# EAGLE design Soil_Moisture_Sensor_Pro_Mini (EAGLE 7.4.0)
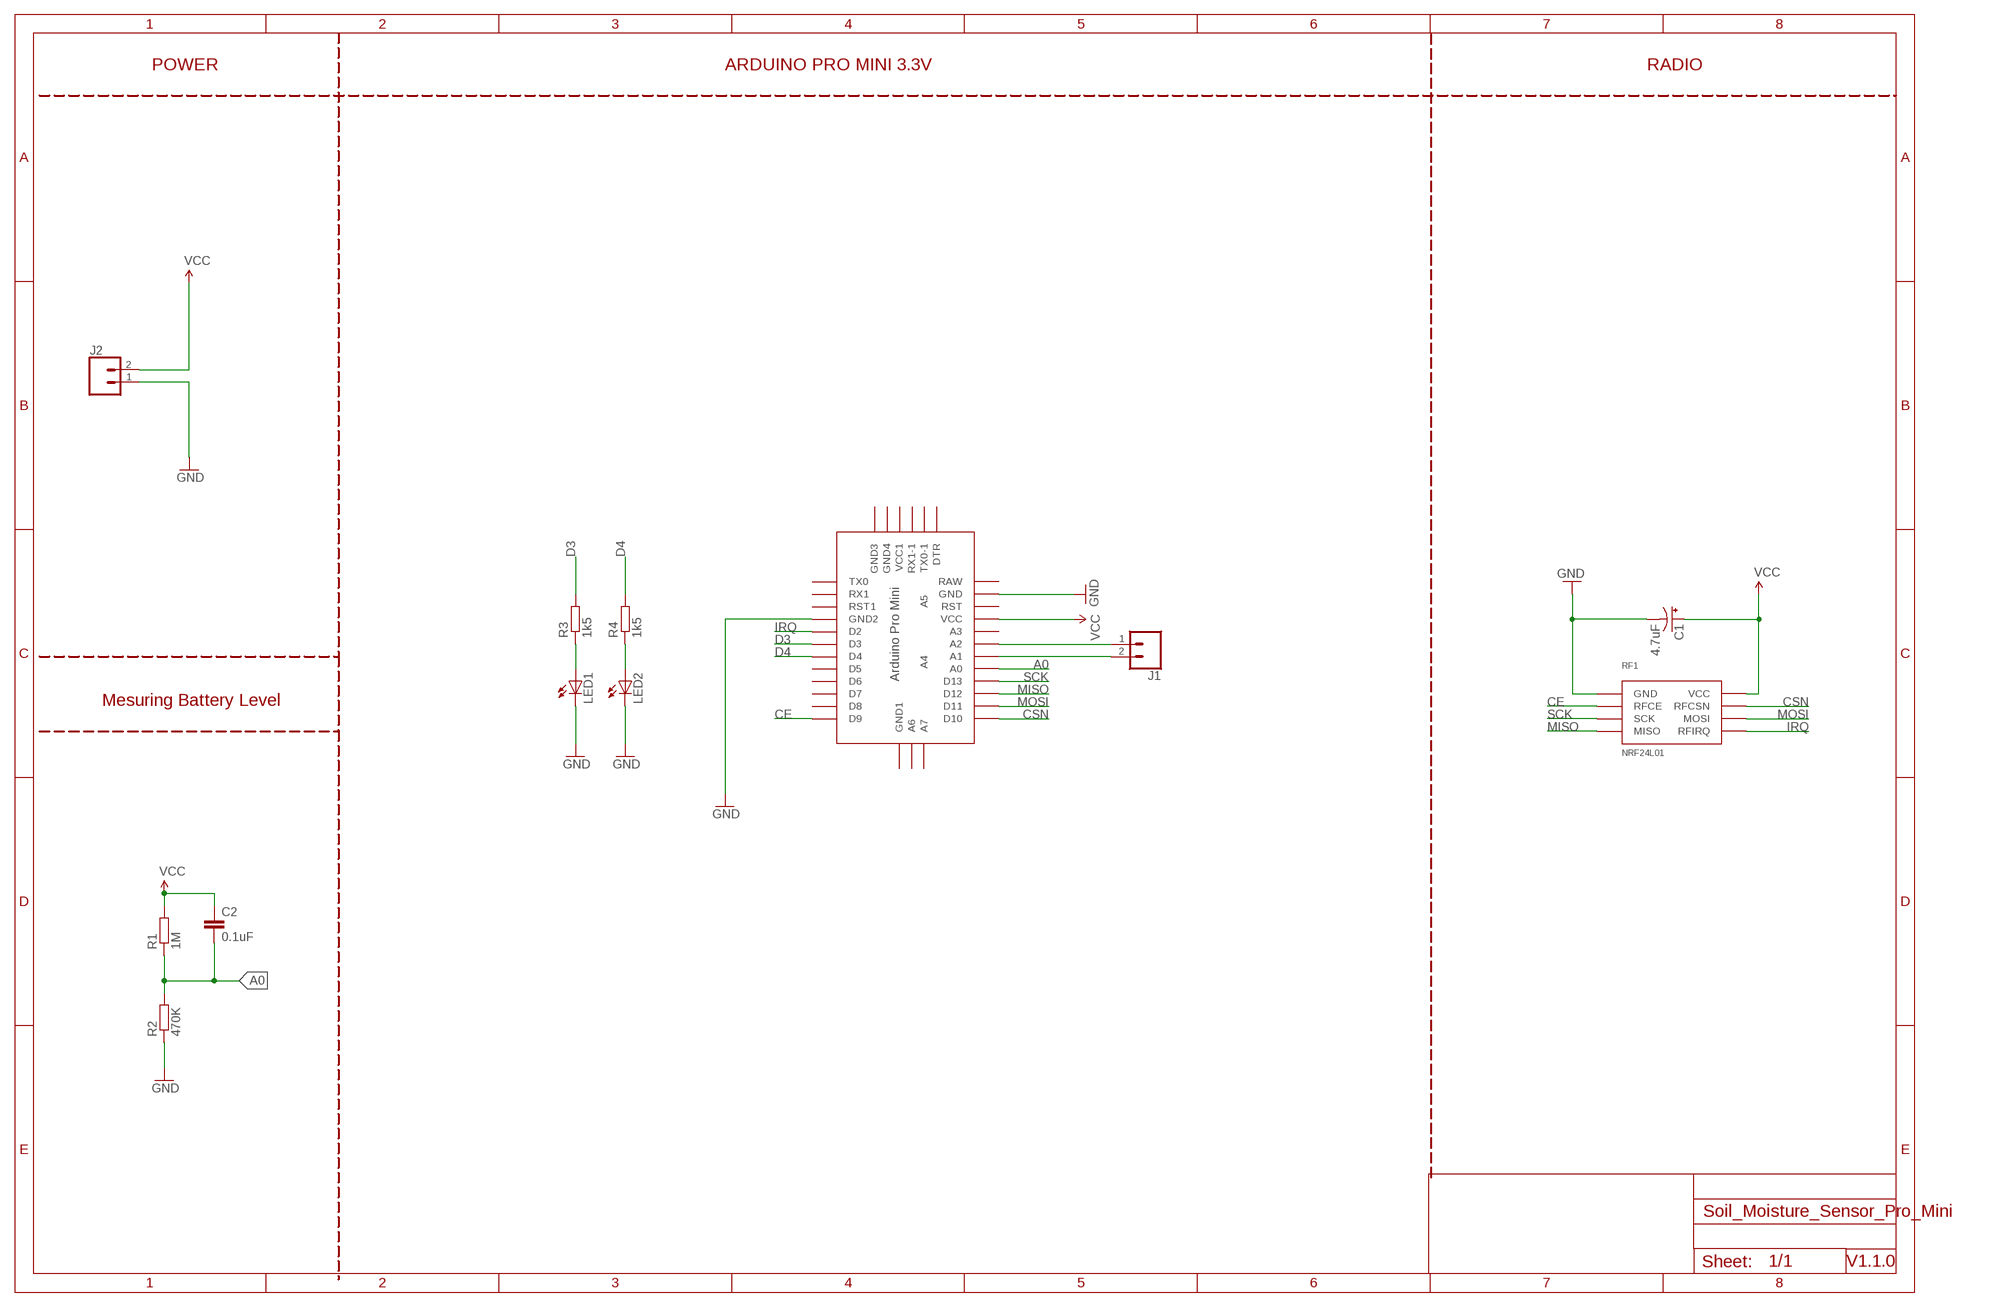
[diagram p0: schematic, sheet 1]

## Parts
C1  4.7uF  CPOL-USE2,5-6E  [E2,5-6E]
C2  0.1uF  C-EU025-025X050  [C025-025X050]
J1  CONN_02  [1X02]
J2  CONN_02  [1X02]
LED1  LED3MM  [LED3MM]
LED2  LED3MM  [LED3MM]
R1  1M  R-EU_0204/7  [0204/7]
R2  470K  R-EU_0204/7  [0204/7]
R3  1k5  R-EU_0204/7  [0204/7]
R4  1k5  R-EU_0204/7  [0204/7]
RF1  NRF24L01  [2X4-2.54MM]
U$1  ABK-PRO-MINI  [ABK-PRO-MINI]

## Nets
A0: C2.2 R1.1 R2.2 U$1.A0
CE: RF1.P$3(RFCE) U$1.D9
CSN: RF1.P$4(RFCSN) U$1.D10
D3: R3.2 U$1.D3
D4: R4.2 U$1.D4
GND [pwr]: C1.- J2.1 LED1.K(C) LED2.K(C) R2.1 RF1.P$1(GND) U$1.GND U$1.GND1(GND2)
IRQ: RF1.P$8(RFIRQ) U$1.D2
MISO: RF1.P$7(MISO) U$1.D12
MOSI: RF1.P$6(MOSI) U$1.D11
N$1: J1.1 U$1.A2
N$2: J1.2 U$1.A1
N$3: LED2.A R4.1
N$4: LED1.A R3.1
SCK: RF1.P$5(SCK) U$1.D13
VCC [pwr]: C1.+ C2.1 J2.2 R1.2 RF1.P$2(VCC) U$1.VCC
Unconnected: U$1.A3 U$1.A4 U$1.A5 U$1.A6 U$1.A7 U$1.D5 U$1.D6 U$1.D7 U$1.D8 U$1.DTR U$1.GND2(GND3) U$1.GND3(GND4) U$1.GND4(GND1) U$1.RAW U$1.RST U$1.RST1 U$1.RX1 U$1.RX1-1 U$1.TX0 U$1.TX0-1 U$1.VCC1

## Notes on the sheet
- POWER | ARDUINO PRO MINI 3.3V | RADIO
- Mesuring Battery Level
- V1.1.0

## Library data of the parts
C1 = adafruit:CPOL-US: POLARIZED CAPACITOR, American symbol
C2 = rcl:C-EU: CAPACITOR, European symbol
J1 J2 = SparkFun-Connectors:CONN_02: Multi connection point. Often used as Generic Header-pin footprint for 0.1 inch spaced/style header connections On any of the 0.1 inch spaced packages, you can populate with these: Break Away Headers - Straight <https://www.sparkfun.com/products/116> (PRT-00116) Break Away Male Headers - Right Angle <https://www.sparkfun.com/products/553> (PRT-00553) Female Headers <https://www.sparkfun.com/products/115> (PRT-00115) Break Away Headers - Machine Pin <https://www.sparkfun.com/products/117> (PRT-00117) Break Away Female Headers - Swiss Machine Pin <https://www.sparkfun.com/products/743> (PRT-00743) For SCREWTERMINALS and SPRING TERMINALS visit here: Screw Terimnals on SparkFun.com <https://www.sparkfun.com/search/results?term=Screw+Terminals> (5mm/3.5mm/2.54mm spacing) This device is also useful as a general connection point to wire up your design to another part of your project. Our various solder wires solder well into these plated through hole pads. Hook-Up Wire - Assortment (Stranded, 22 AWG) <https://www.sparkfun.com/products/11375> (PRT-11375) Hook-Up Wire - Assortment (Solid Core, 22 AWG) <https://www.sparkfun.com/products/11367> (PRT-11367) View the entire wire category on our website here <https://www.sparkfun.com/categories/141> Special notes: Molex polarized connector foot print use with: PRT-08233 with associated crimp pins and housings. 2.54_SCREWTERM for use with PRT-10571. 3.5mm Screw Terminal footprints for PRT-08084 5mm Screw Terminal footprints for use with PRT-08432
LED1 LED2 = led:LED: LED OSRAM: - CHIPLED LG R971, LG N971, LY N971, LG Q971, LY Q971, LO R971, LY R971 LH N974, LH R974 LS Q976, LO Q976, LY Q976 LO Q996 - Hyper CHIPLED LW Q18S LB Q993, LB Q99A, LB R99A - SideLED LS A670, LO A670, LY A670, LG A670, LP A670 LB A673, LV A673, LT A673, LW A673 LH A674 LY A675 LS A676, LA A676, LO A676, LY A676, LW A676 LS A679, LY A679, LG A679 - Hyper Micro SIDELED® LS Y876, LA Y876, LO Y876, LY Y876 LT Y87S - SmartLED LW L88C, LW L88S LB L89C, LB L89S, LG L890 LS L89K, LO L89K, LY L89K LS L896, LA L896, LO L896, LY L896 - TOPLED LS T670, LO T670, LY T670, LG T670, LP T670 LSG T670, LSP T670, LSY T670, LOP T670, LYG T670 LG T671, LOG T671, LSG T671 LB T673, LV T673, LT T673, LW T673 LH T674 LS T676, LA T676, LO T676, LY T676, LB T676, LH T676, LSB T676, LW T676 LB T67C, LV T67C, LT T67C, LS T67K, LO T67K, LY T67K, LW E67C LS E67B, LA E67B, LO E67B, LY E67B, LB E67C, LV E67C, LT E67C LW T67C LS T679, LY T679, LG T679 LS T770, LO T770, LY T770, LG T770, LP T770 LB T773, LV T773, LT T773, LW T773 LH T774 LS E675, LA E675, LY E675, LS T675 LS T776, LA T776, LO T776, LY T776, LB T776 LHGB T686 LT T68C, LB T68C - Hyper Mini TOPLED® LB M676 - Mini TOPLED Santana® LG M470 LS M47K, LO M47K, LY M47K Source: http://www.osram.convergy.de LUXEON: - LUMILED® LXK2-PW12-R00, LXK2-PW12-S00, LXK2-PW14-U00, LXK2-PW14-V00 LXK2-PM12-R00, LXK2-PM12-S00, LXK2-PM14-U00 LXK2-PE12-Q00, LXK2-PE12-R00, LXK2-PE12-S00, LXK2-PE14-T00, LXK2-PE14-U00 LXK2-PB12-K00, LXK2-PB12-L00, LXK2-PB12-M00, LXK2-PB14-N00, LXK2-PB14-P00, LXK2-PB14-Q00 LXK2-PR12-L00, LXK2-PR12-M00, LXK2-PR14-Q00, LXK2-PR14-R00 LXK2-PD12-Q00, LXK2-PD12-R00, LXK2-PD12-S00 LXK2-PH12-R00, LXK2-PH12-S00 LXK2-PL12-P00, LXK2-PL12-Q00, LXK2-PL12-R00 Source: www.luxeon.com KINGBRIGHT: KA-3528ASYC Source: www.kingbright.com
R1-R4 = rcl:R-EU_: RESISTOR, European symbol
RF1 = matrix:NRF24L01
U$1 = Arduino-clone-:ABK-PRO-MINI: ABK Pro-Mini Arduino Clone

## Net classes
1 pwr: width 0.457 mm, clearance 0.254 mm

## Board
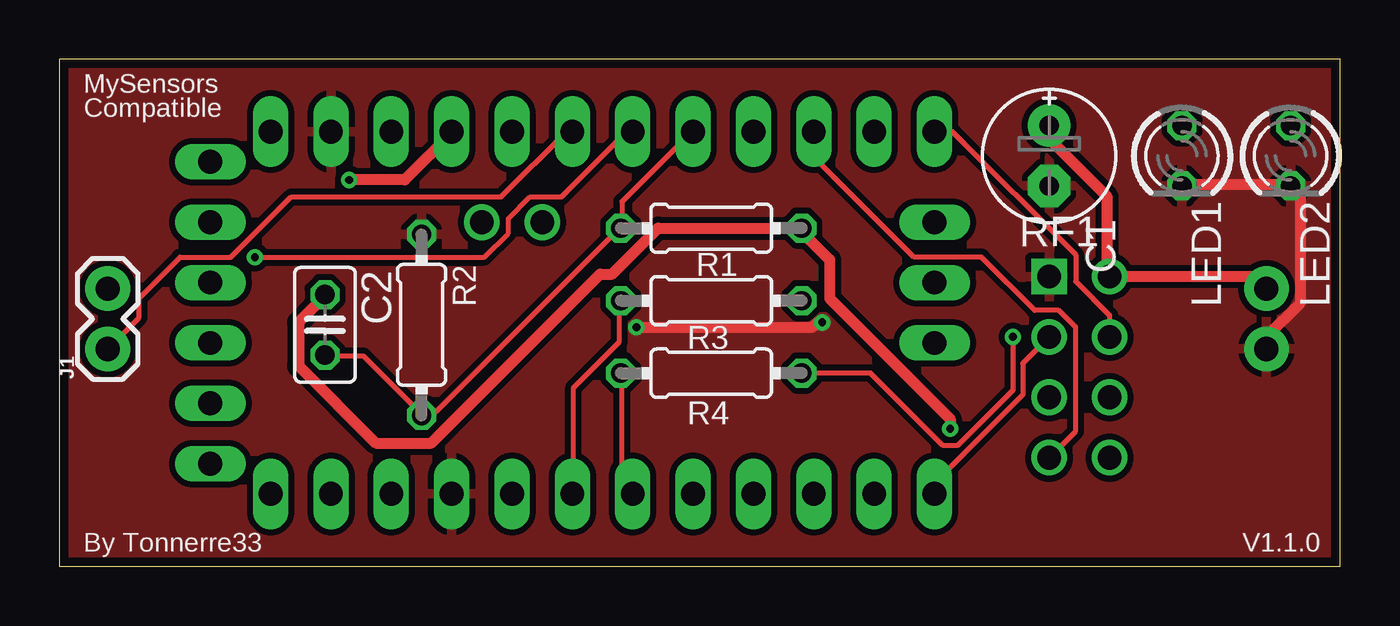
[diagram p1: board, top side]
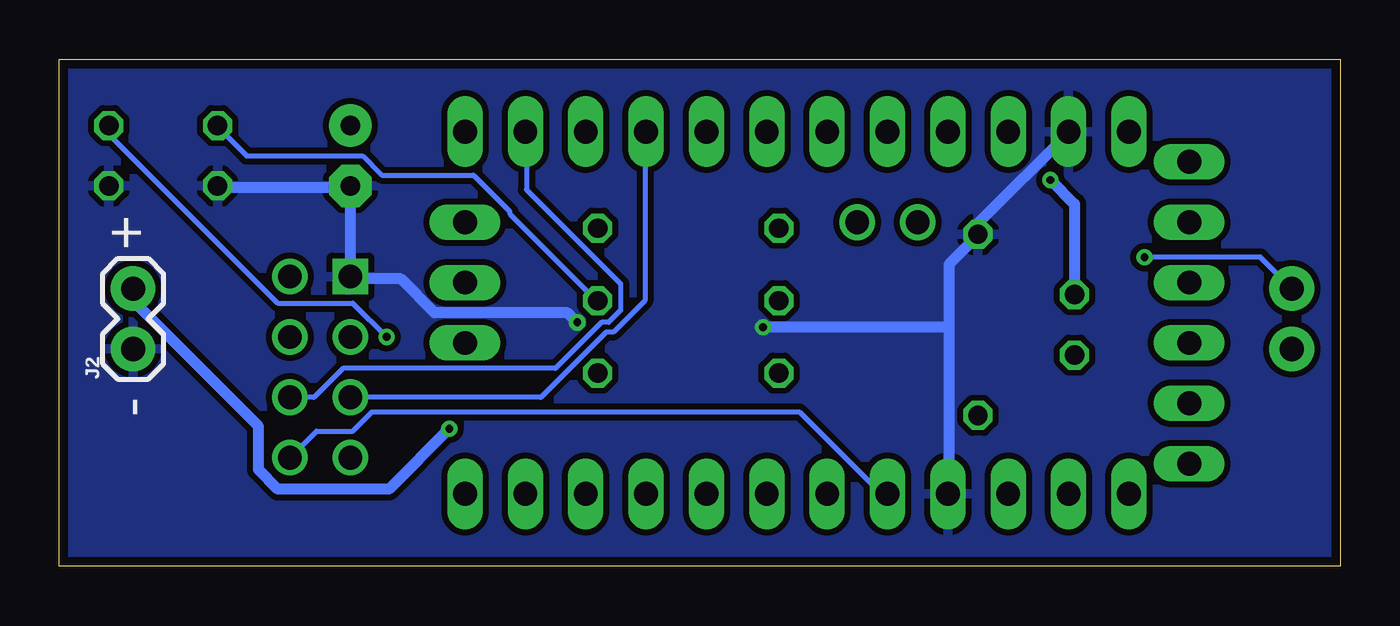
[diagram p2: board, bottom side, seen from below]

Size 53.9 x 21.33 mm. Coordinates in mm from the lower left corner, seen from the top.
Outline: 0,0 53.9,0 53.9,21.33 0,21.33 0,0
Copper layers (1*16): Top 0.0356mm / dielectric 1.5011mm / Bottom 0.0356mm
Design rules "PCBs_io-8mil-jby *": minimum track width 8mil, minimum drill 13mil, track to track 8mil, track to pad 8mil, pad to pad 8mil, via to via 8mil, smd to smd 8mil, copper to edge 15mil, drill to drill 8mil, minimum pad ring 7mil, minimum via ring 7mil, stop-mask expansion 3mil, vias tented up to drill 13mil, thermal gap 10mil

### Footprints (pad centres in the part's own frame; a part is rotated, then mirrored left to right if it is on the bottom)
E2,5-6E = drill 0.813 pad 1.778: + -1.27,0 | drill 0.813 pad 1.778 octagon: - 1.27,0
C025-025X050 = drill 0.813 octagon: 1 -1.27,0; 2 1.27,0
1X02 = drill 1.016 pad 1.88: 1 0,0; 2 2.54,0
LED3MM = drill 0.813 octagon: A -1.27,0; K 1.27,0
0204/7 = drill 0.813 octagon: 1 -3.81,0; 2 3.81,0
2X4-2.54MM = drill 1 square: P$1 0,0 | drill 1: P$2 2.54,0; P$3 0,-2.54; P$4 2.54,-2.54; P$5 0,-5.08; P$6 2.54,-5.08; P$7 0,-7.62; P$8 2.54,-7.62
ABK-PRO-MINI = drill 1 long: A0 10.16,-11.43; A1 10.16,-8.89; A2 10.16,-6.35; A3 10.16,-3.81; A6 3.81,-21.59; A7 6.35,-21.59; D2 -5.08,-3.81; D3 -5.08,-6.35; D4 -5.08,-8.89; D5 -5.08,-11.43; D6 -5.08,-13.97; D7 -5.08,-16.51; D8 -5.08,-19.05; D9 -5.08,-21.59; D10 10.16,-21.59; D11 10.16,-19.05; D12 10.16,-16.51; D13 10.16,-13.97; DTR 8.89,8.89; GND 10.16,3.81; GND1 -5.08,-1.27; GND2 -3.81,8.89; GND3 -1.27,8.89; GND4 1.27,-21.59; RAW 10.16,6.35; RST 10.16,1.27; RST1 -5.08,1.27; RX1 -5.08,3.81; RX1-1 3.81,8.89; TX0 -5.08,6.35; TX0-1 6.35,8.89; VCC 10.16,-1.27; VCC1 1.27,8.89 | drill 1: A4 6.35,-5.08; A5 6.35,-2.54

### Placement (x,y rotation side)
C1  41.66,17.27 270 top
C2  11.18,10.16 270 top
J1  2.03,9.14 90 top
J2  50.8,9.14 90 bottom
LED1  47.24,17.27 270 top
LED2  51.82,17.27 270 top
R1  27.43,14.22 0 top
R2  15.24,10.16 270 top
R3  27.43,11.18 180 top
R4  27.43,8.13 180 top
RF1  41.66,12.19 0 top
U$1  15.24,8.13 90 top

### Tracks (layer width: path | path; a pad name or v marks a point on that pad's centre or on a via)
A0
  Top 0.203: C2.2 11.18,8.84 12.8,8.84 15.24,6.4 R2.2 15.24,6.5 15.85,6.5 23.57,14.22 R1.1 23.67,14.22 23.67,15.34 26.62,18.29 U$1.A0
CE
  Top 0.203: RF1.P$3 40.54,8.53 40.54,7.21 36.88,3.56 36.88,3.05 U$1.D9
CSN
  Top 0.203: RF1.P$4 44.2,10.57 42.77,11.99 42.77,13.11 37.59,18.29 U$1.D10
D3
  Top 0.203: R3.2 23.57,11.18 23.57,9.45 21.64,7.52 21.64,3.05 U$1.D3
D4
  Top 0.203: R4.2 23.67,8.13 23.67,3.45 24.08,3.05 U$1.D4
GND  (via drill 0.33)
  Top 0.457: LED1.K 47.24,16.05 51.82,16.05 LED2.K 51.92,15.85 52.22,15.54 52.22,11.07 50.8,9.65 J2.1 | v32.11,10.26 31.9,10.26 31.7,10.06 v24.28,10.06
  Bottom 0.457: LED1.K 47.24,15.95 41.86,15.95 C1.- RF1.P$1 41.45,12.09 39.52,12.09 38.1,10.67 32.51,10.67 v32.11,10.26 | U$1.GND 11.38,18.29 15.24,14.43 R2.1 15.34,13.82 16.46,12.7 16.46,10.06 | 16.46,10.06 16.46,3.05 U$1.GND1 | 16.46,10.06 v24.28,10.06
  pour Top: -3.05,23.37 -3.05,-2.03 56.9,-2.03 56.9,23.37
  pour Bottom: -1.02,22.35 -1.02,-1.02 55.88,-1.02 55.88,22.35
IRQ
  Bottom 0.203: U$1.D2 19.3,3.05 22.76,6.5 40.74,6.5 41.55,5.69 43.08,5.69 RF1.P$8
MISO
  Top 0.203: RF1.P$7 42.77,5.69 42.77,10.06 42.06,10.77 41.05,10.77 38.81,13 35.97,13 31.8,17.17 31.8,18.29 U$1.D12
MOSI
  Bottom 0.203: RF1.P$6 43.18,7.11 41.96,8.33 33.02,8.33 31.09,10.26 30.79,10.26 30.28,10.77 30.28,11.89 34.24,15.85 34.24,18.29 U$1.D11
N$1
  Top 0.203: U$1.A2 21.34,18.29 18.59,15.54 9.75,15.54 7.21,13 5.08,13 3.35,11.28 3.35,10.46 J1.1
N$2  (via drill 0.33)
  Top 0.203: U$1.A1 23.88,18.29 21.13,15.54 19.81,15.54 18.9,14.63 18.9,14.02 17.88,13 v8.23,13
  Bottom 0.203: v8.23,13 3.35,13 J1.2
N$3  (via drill 0.33)
  Top 0.203: R4.1 34.14,8.13 37.19,5.08 37.8,5.08 40.13,7.42 v40.13,9.65
  Bottom 0.203: v40.13,9.65 41.55,11.07 44.7,11.07 51.82,18.19 LED2.A
N$4
  Bottom 0.203: R3.1 31.29,11.18 34.95,14.83 34.95,14.93 36.47,16.46 40.33,16.46 41.15,17.27 46.03,17.27 47.24,18.49 LED1.A
SCK
  Bottom 0.203: RF1.P$5 33.63,7.11 30.89,9.86 30.58,9.86 29.26,11.18 29.26,18.29 U$1.D13
VCC  (via drill 0.33)
  Top 0.457: J2.2 50.29,12.19 RF1.P$2 44.09,12.39 44.09,15.54 41.66,17.98 C1.+ | v12.19,16.26 14.53,16.26 16.56,18.29 U$1.VCC | C2.1 11.18,11.38 10.06,10.26 10.06,8.43 13.31,5.18 15.65,5.18 22.76,12.29 23.27,12.29 25.2,14.22 R1.2 31.29,14.02 32.41,12.9 32.41,11.28 37.49,6.2 v37.49,5.79
  Bottom 0.457: C2.1 11.18,15.24 v12.19,16.26 | J2.2 50.8,11.18 45.52,5.89 45.52,4.06 44.7,3.25 40.03,3.25 v37.49,5.79

### Text on the board
tPlace: MySensors | Compatible | By Tonnerre33 | V1.1.0
bPlace: + | -